# Altium schematic sheet Cap_Array_100p_400n.SchDoc: Adjustable Capacitor Bank
size A3; Author: M.Beldyga; CompanyName: WUT ISE; DrawnBy: M.Beldyga; Organization: WUT ISE; Address1: PW ISE; Address2: Nowowiejska 15/19 00-665 Warsaw; Address3: micbeldyga@gmail.com; SheetNumber: 3; SheetTotal: 12; ModifiedBy: -; CheckedDate: -; Title2: 10pF-400nF; DivGrp: WUT ISE; Designer: M.Beldyga; ModifiedDate: -; ProjectName: Sensor Box
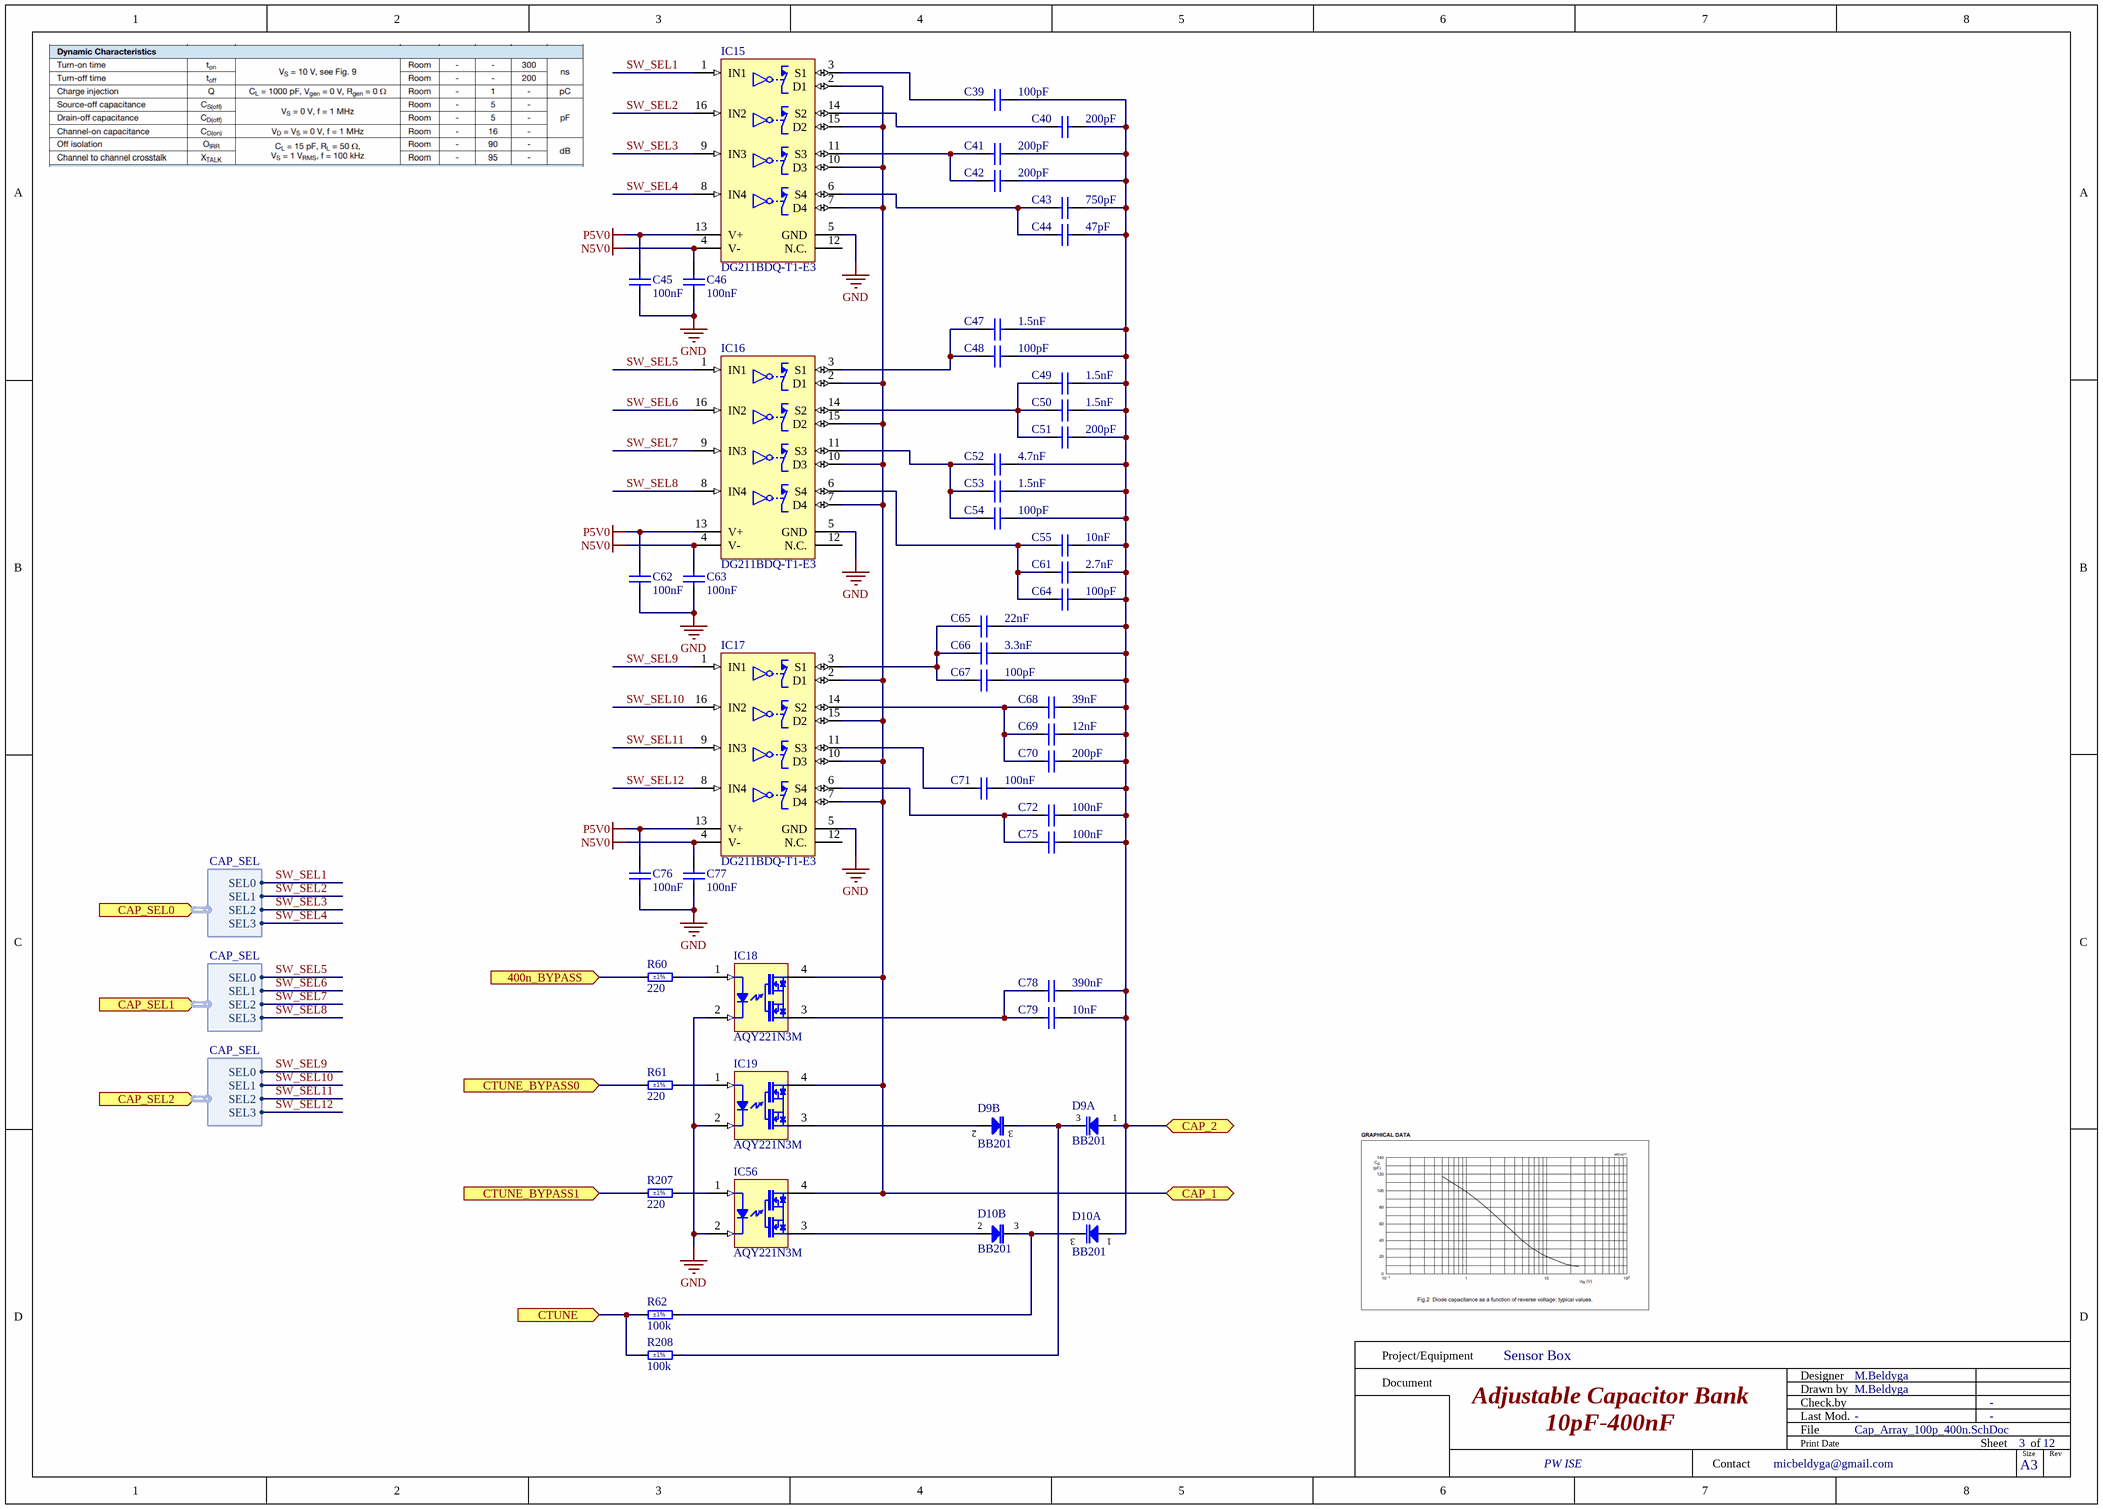
[diagram p0: Cap_Array_100p_400n.SchDoc]

## Parts
C39  100pF  [CAPC1005X55N]
C40  200pF  [CAPC1005X55N]
C41  200pF  [CAPC1005X55N]
C42  200pF  [CAPC1005X55N]
C43  750pF  [CAPC1005X55N]
C44  47pF  [CAPC1005X55N]
C45  100nF  [CAPC1005X55N]
C46  100nF  [CAPC1005X55N]
C47  1.5nF  [CAPC1005X55N]
C48  100pF  [CAPC1005X55N]
C49  1.5nF  [CAPC1005X55N]
C50  1.5nF  [CAPC1005X55N]
C51  200pF  [CAPC1005X55N]
C52  4.7nF  [CAPC1608X90N]
C53  1.5nF  [CAPC1005X55N]
C54  100pF  [CAPC1005X55N]
C55  10nF  [CAPC1608X90N]
C61  2.7nF  [CAPC1608X90N]
C62  100nF  [CAPC1005X55N]
C63  100nF  [CAPC1005X55N]
C64  100pF  [CAPC1005X55N]
C65  22nF  [CAPC2012X95N]
C66  3.3nF  [CAPC1608X90N]
C67  100pF  [CAPC1005X55N]
C68  39nF  [CAPC2012X95N]
C69  12nF  [CAPC1608X90N]
C70  200pF  [CAPC1005X55N]
C71  100nF  [CAPC1810X06N]
C72  100nF  [CAPC1810X06N]
C75  100nF  [CAPC1810X06N]
C76  100nF  [CAPC1005X55N]
C77  100nF  [CAPC1005X55N]
C78  390nF  [CAPC1608X90N]
C79  10nF  [CAPC1608X90N]
D9  BB201  [SOT95P230X110-3N]  (parts A,B of 2)
D10  BB201  [SOT95P230X110-3N]  (parts A,B of 2)
IC15  DG211BDQ-T1-E3  [SOP65P640X120-16N]
IC16  DG211BDQ-T1-E3  [SOP65P640X120-16N]
IC17  DG211BDQ-T1-E3  [SOP65P640X120-16N]
IC18  AQY221N3M  [PANASONIC_AQY22(SON)]
IC19  AQY221N3M  [PANASONIC_AQY22(SON)]
IC56  AQY221N3M  [PANASONIC_AQY22(SON)]
R60  220  Tolerance: ±1%  [RESC1005X40N]
R61  220  Tolerance: ±1%  [RESC1005X40N]
R62  100k  Tolerance: ±1%  [RESC1005X40N]
R207  220  Tolerance: ±1%  [RESC1005X40N]
R208  100k  Tolerance: ±1%  [RESC1005X40N]

## Ports
400n_BYPASS (in), CAP_1 (bidir), CAP_2 (bidir), CAP_SEL0 (in, harness CAP_SEL), CAP_SEL1 (in, harness CAP_SEL), CAP_SEL2 (in, harness CAP_SEL), CTUNE (in), CTUNE_BYPASS0 (in), CTUNE_BYPASS1 (in)

## Harnesses
CAP_SEL: SEL0, SEL1, SEL2, SEL3

## Nets
GND: C45.1 C46.1 C62.1 C63.1 C76.1 C77.1 IC15.5(GND) IC16.5(GND) IC17.5(GND) IC18.2(K) IC19.2(K) IC56.2(K)
N5V0: C46.2 C63.2 C77.2 IC15.4(V-) IC16.4(V-) IC17.4(V-)
P5V0: C45.2 C62.2 C76.2 IC15.13(V+) IC16.13(V+) IC17.13(V+)
400n_BYPASS: R60.1 ; port 400n_BYPASS
CAP_1: IC15.2(D1) IC15.7(D4) IC15.10(D3) IC15.15(D2) IC16.2(D1) IC16.7(D4) IC16.10(D3) IC16.15(D2) IC17.2(D1) IC17.7(D4) IC17.10(D3) IC17.15(D2) IC18.4(E) IC19.4(E) IC56.4(E) ; port CAP_1
CAP_2: C39.2 C40.1 C41.1 C42.1 C43.1 C44.2 C47.1 C48.2 C49.1 C50.1 C51.1 C52.1 C53.1 C54.2 C55.1 C61.1 C64.2 C65.1 C66.1 C67.2 C68.1 C69.1 C70.1 C71.1 C72.1 C75.1 C78.1 C79.1 D9.1(A) D10.1(A) ; port CAP_2
CTUNE: R62.2 R208.2 ; port CTUNE
CTUNE_BYPASS0: R61.1 ; port CTUNE_BYPASS0
CTUNE_BYPASS1: R207.1 ; port CTUNE_BYPASS1
SW_SEL1: IC15.1(IN1) ; port CAP_SEL0.SEL0
SW_SEL2: IC15.16(IN2) ; port CAP_SEL0.SEL1
SW_SEL3: IC15.9(IN3) ; port CAP_SEL0.SEL2
SW_SEL4: IC15.8(IN4) ; port CAP_SEL0.SEL3
SW_SEL5: IC16.1(IN1) ; port CAP_SEL1.SEL0
SW_SEL6: IC16.16(IN2) ; port CAP_SEL1.SEL1
SW_SEL7: IC16.9(IN3) ; port CAP_SEL1.SEL2
SW_SEL8: IC16.8(IN4) ; port CAP_SEL1.SEL3
SW_SEL9: IC17.1(IN1) ; port CAP_SEL2.SEL0
SW_SEL10: IC17.16(IN2) ; port CAP_SEL2.SEL1
SW_SEL11: IC17.9(IN3) ; port CAP_SEL2.SEL2
SW_SEL12: IC17.8(IN4) ; port CAP_SEL2.SEL3
NetC39_1: C39.1 IC15.3(S1)
NetC40_2: C40.2 IC15.14(S2)
NetC41_2: C41.2 C42.2 IC15.11(S3)
NetC43_2: C43.2 C44.1 IC15.6(S4)
NetC47_2: C47.2 C48.1 IC16.3(S1)
NetC49_2: C49.2 C50.2 C51.2 IC16.14(S2)
NetC52_2: C52.2 C53.2 C54.1 IC16.11(S3)
NetC55_2: C55.2 C61.2 C64.1 IC16.6(S4)
NetC65_2: C65.2 C66.2 C67.1 IC17.3(S1)
NetC68_2: C68.2 C69.2 C70.2 IC17.14(S2)
NetC71_2: C71.2 IC17.11(S3)
NetC72_2: C72.2 C75.2 IC17.6(S4)
NetC78_2: C78.2 C79.2 IC18.3(C)
NetD9_2: D9.2(A) IC19.3(C)
NetD9_3: D9.3(COMC) R208.1
NetD10_2: D10.2(A) IC56.3(C)
NetD10_3: D10.3(COMC) R62.1
NetIC18_1: IC18.1(A) R60.2
NetIC19_1: IC19.1(A) R61.2
NetIC56_1: IC56.1(A) R207.2

Not connected (* = marked no-connect by the designer): IC15 12(N.C.); IC16 12(N.C.); IC17 12(N.C.)

## Notes on the sheet
- Project/Equipment
- Document
- Designer
- Drawn by
- Check.by
- Contact
- File
- Last Mod.
- Print Date
- Sheet
- Size
- A3
- of
- Rev

## Library data of the parts
C39 C48 C54 C64 C67 = CC0402_100PF_25V_1%_C0G: Non-polarised capacitor; Part Description: SMD Multilayer Chip Ceramic Capacitor; Manufacturer: GENERIC; Manufacturer1 Part Number: CBR04C101F3GAC; Voltage: 25V; TC: C0G/NP0; Tolerance: ±1%; Part Number: CC0402_100PF_25V_1%_C0G; Component Kind: Standard; Component Type: Standard; Pin Count: 2; Value: 100pF; Status: Not Recommended; Manufacturer Part Number: CC0402_100PF_25V_1%_C0G; Case: 0402; Mounted: Yes; Socket: No; SMD: Yes; Sense: No; Manufacturer1 Example: KEMET; Manufacturer1 ComponentHeight: 0.55mm; HelpURL: \\cern.ch\dfs\Applications\Altium\Datasheets\CC0402_C0G_KEMET_HiQ-CBR.pdf; Author: CERN DEM HF; CreateDate: 10/20/2022; LatestRevisionDate: 10/20/2022
C40-C42 C51 C70 = 0402 200pF 50V: Multilayer Ceramic Capacitor, 200 pF, 50 V, ï¿½ 1%, C0G (NP0), 0402 [1005 Metric]; Manufacturer: Murata; Manufacturer Part Number: GCM1555C1H201FA16D; Material: 4241ConductorMaterial; Temperature Coefficient: 30ppm/°C; Voltage Rating: 50V; Supplier: Mouser; Supplier Part Number: 81-GCM1555C1H201FA6D; RoHS: Yes; Category: Ceramic Capacitors; Stock: 21118; Pricing: 1=0.1, 10=0.035, 50=0.035, 100=0.021, 1000=0.016, 10000=0.009 (USD); Case/Package: 343Case; Min Operating Temperature: -55°C; Max Operating Temperature: 125°C; Value: 200pF; Length: 1mm; Width: 500um; Height: 550um; Thickness: 500um; RoHS Compliant: Yes; ComponentLink1URL: https://datasheet.octopart.com/GCM1555C1H201FA16D-Murata-datasheet-12511495.pdf?src-supplier=TME; ComponentLink1Description: https://datasheet.octopart.com/GCM1555C1H201FA16D-Murata-datasheet-12511495.pdf?src-supplier=TME
C43 = 0402 750pF 50V: Cap Auto-grade 750PF 50VDC C0G 1% SMD 0402; Manufacturer: Murata; Manufacturer Part Number: GCM1555C1H751FA16D; Supplier: Mouser; Supplier Part Number: 81-GCM1555C1H751FA6D; RoHS: Yes; Category: Ceramic Capacitors; Stock: 21110; Pricing: 1=0.1, 10=0.04, 50=0.04, 100=0.024, 1000=0.017, 10000=0.01 (USD); RoHS Compliant: Yes
C44 = CC0402_47PF_50V_1%_C0G_MURATA_GJM1555C1H470FB01D: Non-polarised capacitor; Part Description: High-Q SMD Chip Monolithic Ceramic Capacitor; Manufacturer: MURATA; Voltage: 50V; TC: C0G/NP0; Tolerance: ±1%; Part Number: CC0402_47PF_50V_1%_C0G_MURATA_GJM1555C1H470FB01D; Component Kind: Standard; Component Type: Standard; Pin Count: 2; Value: 47pF; Status: None; Manufacturer Part Number: GJM1555C1H470FB01; Case: 0402; Mounted: Yes; Socket: No; SMD: Yes; Sense: No; ComponentHeight: 0.55mm; HelpURL: \\cern.ch\dfs\Applications\Altium\Datasheets\CC0402_MURATA_GJM1555C1H470FB01D.pdf; Author: CERN DEM BC; CreateDate: 11/20/2017; LatestRevisionDate: 11/20/2017
C45 C46 C62 C63 C76 C77 = CC0402_100NF_50V_10%_X7R: Non-polarised capacitor; Part Description: SMD Multilayer Chip Ceramic Capacitor; Manufacturer: GENERIC; Manufacturer1 Part Number: GRM155R71H104KE14D; Voltage: 50V; TC: X7R; Tolerance: ±10%; Part Number: CC0402_100NF_50V_10%_X7R; Component Kind: Standard; Component Type: Standard; Pin Count: 2; Value: 100nF; Status: None; Manufacturer Part Number: CC0402_100NF_50V_10%_X7R; Case: 0402; Mounted: Yes; Socket: No; SMD: Yes; Sense: No; Manufacturer1 Example: MURATA; Manufacturer1 ComponentHeight: 0.55mm; HelpURL: \\cern.ch\dfs\Applications\Altium\Datasheets\CC0402_MURATA_GRM155R71H104KE14D.pdf; Author: CERN DEM MR; CreateDate: 6/30/2017; LatestRevisionDate: 6/30/2017
C47 C49 C50 C53 = 0402 1.5nF 50V: ESD SMD Auto C0G 0402 (1005Metric) Ceramic Capacitor 0.039Lx0.020W 1.00mmx0.50mm C0G NP0 ±1% 1500pF; Manufacturer: KEMET; Manufacturer Part Number: C0402C152F5GECAUTO; Supplier: Mouser; Supplier Part Number: 80-C0402C152F5GECAUT; RoHS: Yes; Category: Ceramic Capacitors; Stock: 2168; Pricing: 1=0.59, 10=0.367, 50=0.367, 100=0.251, 1000=0.19, 10000=0.151 (USD); RoHS Compliant: Yes; ComponentLink1URL: https://datasheet.octopart.com/C0402C152F5GECAUTO-KEMET-datasheet-154276015.pdf?src-supplier=Farnell; ComponentLink1Description: https://datasheet.octopart.com/C0402C152F5GECAUTO-KEMET-datasheet-154276015.pdf?src-supplier=Farnell; ComponentLink2URL: https://api.kemet.com/component-edge/download/datasheet/C0402C152F5GECAUTO.pdf?src-supplier=Digikey; ComponentLink2Description: https://api.kemet.com/component-edge/download/datasheet/C0402C152F5GECAUTO.pdf?src-supplier=Digikey; ComponentLink3URL: https://datasheet.octopart.com/C0402C152F5GECAUTO-KEMET-datasheet-185374772.pdf?src-supplier=Newark; ComponentLink3Description: https://datasheet.octopart.com/C0402C152F5GECAUTO-KEMET-datasheet-185374772.pdf?src-supplier=Newark
C52 = 0603 4.7nF 50V: Cap Ceramic 0.0047uF 50V C0G 1% Pad SMD 0603 125°C Automotive T/R; Manufacturer: Murata; Manufacturer Part Number: GCM1885C1H472FA16D; Temperature Coefficient: 30ppm/°C; Supplier: Mouser; Supplier Part Number: 81-GCM1885C1H472FA6D; RoHS: Yes; Category: Ceramic Capacitors; Stock: 7633; Pricing: 1=0.18, 10=0.102, 50=0.102, 100=0.064, 1000=0.044, 10000=0.03 (USD); Case/Package: 0603; Material: Ceramic; Min Operating Temperature: -55°C; Max Operating Temperature: 125°C; Value: 4.7nF; Tolerance: 1%; Voltage Rating: 50V; Length: 1.6mm; Width: 800um; Height: 900um; Thickness: 800um
C55 C79 = 0603 10nF 25V: Multilayer Ceramic Capacitors MLCC - SMD/SMT 25V 0.01uF C0G 0603 1% AEC-Q200; Manufacturer: KEMET; Manufacturer Part Number: C0603C103F3GECAUTO; Supplier: Mouser; Supplier Part Number: 80-C0603C103F3GEAUTO; RoHS: Yes; Category: Ceramic Capacitors; Stock: 14714; Pricing: 1=0.8, 10=0.507, 50=0.507, 100=0.354, 1000=0.284, 10000=0.239 (USD); Value: 10nF; Voltage Rating (DC): 25V; RoHS Compliant: Yes; ComponentLink1URL: https://datasheet.octopart.com/C0603C103F3GECAUTO-KEMET-datasheet-149521794.pdf?src-supplier=Farnell; ComponentLink1Description: https://datasheet.octopart.com/C0603C103F3GECAUTO-KEMET-datasheet-149521794.pdf?src-supplier=Farnell
C61 = 0603 2.7nF 50V: Powerrain/Safety for Automotive AEC-Q200 Up to 125C Reflow soldering Flow soldering; Manufacturer: Murata; Manufacturer Part Number: GCM1885C1H272FA16J; Supplier: Mouser; Supplier Part Number: 81-GCM1885C1H272FA6J; RoHS: Yes; Category: Ceramic Capacitors; Stock: 14497; Pricing: 1=0.17, 10=0.098, 50=0.098, 100=0.061, 1000=0.042, 10000=0.029 (USD); RoHS Compliant: Yes
C65 = 0805 22nF 50V: 0805 50V C0G 0.022uF 1% Automotive grade multilayer ceramic capacitor; Manufacturer: Murata; Manufacturer Part Number: GCM21B5C1H223FA16L; Supplier: Mouser; Supplier Part Number: 81-GCM21B5C1H223FA6L; RoHS: Yes; Category: Ceramic Capacitors; Stock: 27751; Pricing: 1=0.53, 10=0.326, 50=0.326, 100=0.221, 1000=0.168, 10000=0.127 (USD); RoHS Compliant: Yes; ComponentLink1URL: https://datasheet.octopart.com/GCM21B5C1H223FA16L-Murata-datasheet-155238815.pdf?src-supplier=Farnell; ComponentLink1Description: https://datasheet.octopart.com/GCM21B5C1H223FA16L-Murata-datasheet-155238815.pdf?src-supplier=Farnell; ComponentLink2URL: https://datasheet.octopart.com/GCM21B5C1H223FA16L-Murata-datasheet-12511495.pdf?src-supplier=TME; ComponentLink2Description: https://datasheet.octopart.com/GCM21B5C1H223FA16L-Murata-datasheet-12511495.pdf?src-supplier=TME
C66 = 0603 3.3nF 50V: Cap Ceramic 0.0033uF 50V C0G 1% Pad SMD 0603 125°C Automotive T/R; Manufacturer: Murata; Manufacturer Part Number: GCM1885C1H332FA16D; Temperature Coefficient: 30ppm/°C; Supplier: Mouser; Supplier Part Number: 81-GCM1885C1H332FA6D; RoHS: Yes; Category: Ceramic Capacitors; Stock: 4669; Pricing: 1=0.17, 10=0.096, 50=0.096, 100=0.06, 1000=0.041, 10000=0.029 (USD); Case/Package: 0603; Material: Ceramic; Min Operating Temperature: -55°C; Max Operating Temperature: 125°C; Value: 3.3nF; Tolerance: 1%; Voltage Rating: 50V; Length: 1.6mm; Width: 800um; Height: 900um; Thickness: 800um; RoHS Compliant: Yes; ComponentLink1URL: https://datasheet.octopart.com/GCM1885C1H332FA16D-Murata-datasheet-12511495.pdf?src-supplier=TME; ComponentLink1Description: https://datasheet.octopart.com/GCM1885C1H332FA16D-Murata-datasheet-12511495.pdf?src-supplier=TME
C68 = 0805 39nF 100V: Multilayer Ceramic Capacitors MLCC - SMD/SMT 0805 C0G 39000pF 2% 100VDC; Manufacturer: Murata; Manufacturer Part Number: GRM2195C2A393GE01J; Voltage Rating (DC): 100V; Supplier: Mouser; Supplier Part Number: 81-GRM2195C2A393GE1J; RoHS: No; Category: Ceramic Capacitors; Stock: 9963; Pricing: 1=0.43, 10=0.259, 50=0.259, 100=0.172, 500=0.16, 1000=0.127, 2500=0.109, 10000=0.098, 20000=0.096, 50000=0.093 (USD); Case/Package: 0805; Value: 39nF; Length: 2mm; Width: 1.25mm; Thickness: 850um; ComponentLink1URL: https://datasheet.octopart.com/GRM2195C2A393GE01J-Murata-datasheet-165579666.pdf?src-supplier=TME; ComponentLink1Description: https://datasheet.octopart.com/GRM2195C2A393GE01J-Murata-datasheet-165579666.pdf?src-supplier=TME
C69 = 0603 12nF 25V: Cap Ceramic 0.012uF 25V C0G 1% Pad SMD 0603 125°C Extreme Low ESR T/R; Manufacturer: KEMET; Manufacturer Part Number: C0603C123F3GACTU; Temperature Coefficient: 30ppm/°C; Supplier: Mouser; Supplier Part Number: 80-C0603C123F3G; RoHS: Yes; Category: Ceramic Capacitors; Stock: 7993; Pricing: 1=1.6, 10=1.07, 50=1.07, 100=0.752, 1000=0.622, 10000=0.509 (USD); Case/Package: 0603; Case Code (Imperial): 0603; Case Code (Metric): 1608; Dielectric Material: Ceramic; Material: Ceramic; Min Operating Temperature: -55°C; Max Operating Temperature: 125°C; Value: 12nF; Packaging: Tape and Reel; Package Quantity: 4000; Tolerance: 1%; Voltage Rating: 25V; Voltage Rating (DC): 25V; Termination: SMD/SMT; Series: C0603C; Height: 870um; Lead Free: Lead Free; RoHS Compliant: Yes; ComponentLink1URL: http://www.mouser.com/ds/2/212/KEM_C1003_C0G_SMD-1101588.pdf?src-supplier=Mouser; ComponentLink1Description: http://www.mouser.com/ds/2/212/KEM_C1003_C0G_SMD-1101588.pdf?src-supplier=Mouser; ComponentLink2URL: https://datasheet.octopart.com/C0603C123F3GACTU-KEMET-datasheet-68331921.pdf?src-supplier=Farnell; ComponentLink2Description: https://datasheet.octopart.com/C0603C123F3GACTU-KEMET-datasheet-68331921.pdf?src-supplier=Farnell; ComponentLink3URL: https://datasheet.octopart.com/C0603C123F3GACTU-KEMET-datasheet-178088019.pdf?src-supplier=Element14; ComponentLink3Description: https://datasheet.octopart.com/C0603C123F3GACTU-KEMET-datasheet-178088019.pdf?src-supplier=Element14; ComponentLink4URL: https://datasheet.octopart.com/C0603C123F3GACTU-KEMET-datasheet-170576060.pdf?src-supplier=Newark; ComponentLink4Description: https://datasheet.octopart.com/C0603C123F3GACTU-KEMET-datasheet-170576060.pdf?src-supplier=Newark; ComponentLink5URL: https://datasheet.octopart.com/C0603C123F3GACTU-KEMET-datasheet-157246123.pdf?src-supplier=Electro+Sonic; ComponentLink5Description: https://datasheet.octopart.com/C0603C123F3GACTU-KEMET-datasheet-157246123.pdf?src-supplier=Electro+Sonic
C71 C72 C75 = 0704 100nF 50V: Cap Cer 0.1UF 50V C0G/NP0 0704; Manufacturer: Murata; Manufacturer Part Number: GRMJN65C1H104GE01J; Material: 4241ConductorMaterial; Temperature Coefficient: 30ppm/°C; Tolerance: 2%; Supplier: Mouser; Supplier Part Number: 81-GRMJN65C1H104GE1J; RoHS: No; Stock: 3204; Pricing: 1=0.52, 10=0.317, 50=0.317, 100=0.211, 1000=0.175, 10000=0.126 (USD); Case/Package: 705Case; Min Operating Temperature: -55°C; Max Operating Temperature: 125°C; Value: 100nF; Voltage Rating: 50V; Height: 650um
C78 = 0603 390nF 16V: Cap Ceramic 0.39uF 16V X7R 5% Pad SMD 0603 125C T/R; Manufacturer: KEMET; Manufacturer Part Number: C0603C394J4RACTU; Temperature Coefficient: 30ppm/°C; Supplier: Mouser; Supplier Part Number: 80-C0603C394J4R; RoHS: Yes; Category: Ceramic Capacitors; Stock: 11683; Pricing: 1=0.36, 10=0.213, 50=0.213, 100=0.14, 1000=0.102, 10000=0.077 (USD); Case/Package: 0603; Dielectric Material: Ceramic; Material: Ceramic; Case Code (Imperial): 0603; Case Code (Metric): 1608; Min Operating Temperature: -55°C; Max Operating Temperature: 125°C; Value: 390nF; Tolerance: 5%; Voltage Rating: 16V; Voltage Rating (DC): 16V; Termination: SMD/SMT; Packaging: Tape and Reel; Package Quantity: 4000; Series: C0603C; Height: 870um; RoHS Compliant: Yes; ComponentLink1URL: http://www.mouser.com/ds/2/212/KEM_C1002_X7R_SMD-1102033.pdf?src-supplier=Mouser; ComponentLink1Description: http://www.mouser.com/ds/2/212/KEM_C1002_X7R_SMD-1102033.pdf?src-supplier=Mouser; ComponentLink2URL: https://datasheet.octopart.com/C0603C394J4RACTU-KEMET-datasheet-130256537.pdf?src-supplier=Farnell; ComponentLink2Description: https://datasheet.octopart.com/C0603C394J4RACTU-KEMET-datasheet-130256537.pdf?src-supplier=Farnell; ComponentLink3URL: https://datasheet.octopart.com/C0603C394J4RACTU-KEMET-datasheet-175422952.pdf?src-supplier=Newark; ComponentLink3Description: https://datasheet.octopart.com/C0603C394J4RACTU-KEMET-datasheet-175422952.pdf?src-supplier=Newark; ComponentLink4URL: https://datasheet.octopart.com/C0603C394J4RACTU-KEMET-datasheet-157246124.pdf?src-supplier=Electro+Sonic; ComponentLink4Description: https://datasheet.octopart.com/C0603C394J4RACTU-KEMET-datasheet-157246124.pdf?src-supplier=Electro+Sonic
D9 D10 = BB201: Dual Common Cathode Varicap Diodes; Part Description: Dual Common Cathode Low-voltage Variable Capacitance Diode; Manufacturer: NXP SEMICONDUCTORS; Voltage: 15V; Power: 20mA; PressFit: No; Bonding: No; Part Number: BB201; Component Kind: Standard; Component Type: Standard; Device: BB201; PackageDescription: SOT, 0.95mm Pitch; 3 Pin, 1.30mm W X 2.90mm L X 1.10mm H body, IPC Medium Density; Manufacturer Part Number: BB201; Pin Count: 3; Case: SOT23-3; Mounted: Yes; Socket: No; SMD: Yes; Sense: No; ComponentHeight: 1.1mm; HelpURL: \\cern.ch\dfs\Applications\Altium\Datasheets\BB201.pdf; Author: CERN DEM JLC; CreateDate: 12/16/2013; LatestRevisionDate: 12/16/2013
IC15-IC17 = DG211BDQ-T1-E3: DG211B Series SPST 22 V 50 Ohm Surface Mount Improved Analog Switch - TSSOP-16; Manufacturer: Vishay Siliconix; Number of Channels: 4; Max Supply Voltage: 25V; Min Supply Voltage: 4.5V; Max Dual Supply Voltage: 22V; Max Power Dissipation: 640mW; Max Supply Current: 10uA; Supply Type: Single,Dual; Supply Current: 50uA; Supplier: Digikey; Supplier Part Number: DG211BDQ-T1-E3CT-ND; Manufacturer Part Number: DG211BDQ-T1-E3; RoHS: Yes; Category: Decoders and Multiplexers; Stock: 12512; Pricing: 1=2.28, 10=1.689, 25=1.5416, 100=1.3792, 250=1.30176, 500=1.2551, 1000=1.2167 (USD); Mounting Technology: Surface Mount; Case/Package: TSSOP; Pins: 16; Weight: 0.006102oz; Min Operating Temperature: -40°C; Max Operating Temperature: 85°C; Package Quantity: 3000; Packaging: Tape and Reel; Number of Inputs: 4; Number of Outputs: 4; Min Dual Supply Voltage: 4.5V; Power Dissipation: 640mW; Throw Configuration: SPST; Series: -; Number of Circuits: 4; Length: 5.08mm; Width: 4.4mm; Height: 0.92mm; Radiation Hardening: No; Lead Free: Lead Free; RoHS Compliant: Yes; Reach SVHC Compliant: Unknown; ComponentLink1URL: https://datasheet.ciiva.com/26911/getdatasheetpartid-399112-26911024.pdf?src-supplier=Verical; ComponentLink1Description: https://datasheet.ciiva.com/26911/getdatasheetpartid-399112-26911024.pdf?src-supplier=Verical; ComponentLink2URL: https://datasheet.ciiva.com/23943/1759079-23943571.pdf?src-supplier=Newark; ComponentLink2Description: https://datasheet.ciiva.com/23943/1759079-23943571.pdf?src-supplier=Newark; ComponentLink3URL: https://datasheet.ciiva.com/6639/70040-6639199.pdf?src-supplier=Digikey; ComponentLink3Description: https://datasheet.ciiva.com/6639/70040-6639199.pdf?src-supplier=Digikey
IC18 IC19 IC56 = AQY221N3M: PhotoMOS Relay; Part Description: RF SON 1 Form A, PhotoMOS Relay, CxR5 (On Res. 5.5Ohm, Out Cap. 1.1pF), 25V 150mA; Manufacturer: PANASONIC; PressFit: No; Bonding: No; Part Number: AQY221N3M; Component Kind: Standard; Component Type: Standard; Device: AQY221N3M; PackageDescription: PANASONIC Serie AQY22(SON), 1.27mm Pitch; 4 Pin, 2.95mm W X 2.20mm L X 1.60mm H body; Manufacturer Part Number: AQY221N3M; Pin Count: 4; Case: SON4; Mounted: Yes; Socket: No; SMD: Yes; Sense: No; ComponentHeight: 1.4mm; HelpURL: \\cern.ch\dfs\Applications\Altium\Datasheets\AQY221N3M.pdf; ComponentLink1Description: Package Drawing; ComponentLink1URL: \\cern.ch\dfs\Applications\Altium\Datasheets\AQY22_Package-Drawing.pdf; Author: CERN DEM JLC; CreateDate: 1/18/2010; LatestRevisionDate: 12/5/2018
R60 R61 R207 = R0402_220R_1%_0.0625W_100PPM: Resistor - 1%; Part Description: General Purpose Thick Film Chip Resistor; Manufacturer: GENERIC; Manufacturer1 Part Number: 232270672201L; TC: ±100ppm/°C; PressFit: No; Part Number: R0402_220R_1%_0.0625W_100PPM; Component Kind: Standard; Component Type: Standard; Pin Count: 2; Value: 220; Status: Not Recommended; Power: 0.0625W; Manufacturer Part Number: R0402_220R_1%_0.0625W_100PPM; Case: 0402; Mounted: Yes; Sense: No; Socket: No; SMD: Yes; Manufacturer1 Example: YAGEO PHYCOMP; Manufacturer1 ComponentHeight: 0.4mm; HelpURL: \\cern.ch\dfs\Applications\Altium\Datasheets\R0402_Phycomp_RC0402.pdf; Author: CERN DEM JLC; CreateDate: 12/3/2007; LatestRevisionDate: 10/17/2012
R62 R208 = R0402_100K_1%_0.0625W_100PPM: Resistor - 1%; Part Description: General Purpose Thick Film Chip Resistor; Manufacturer: GENERIC; Manufacturer1 Part Number: 232270671004L; TC: ±100ppm/°C; PressFit: No; Part Number: R0402_100K_1%_0.0625W_100PPM; Component Kind: Standard; Component Type: Standard; Pin Count: 2; Value: 100k; Status: Not Recommended; Power: 0.0625W; Manufacturer Part Number: R0402_100K_1%_0.0625W_100PPM; Case: 0402; Mounted: Yes; Sense: No; Socket: No; SMD: Yes; Manufacturer1 Example: YAGEO PHYCOMP; Manufacturer1 ComponentHeight: 0.4mm; HelpURL: \\cern.ch\dfs\Applications\Altium\Datasheets\R0402_Phycomp_RC0402.pdf; Author: CERN DEM JLC; CreateDate: 12/3/2007; LatestRevisionDate: 10/17/2012